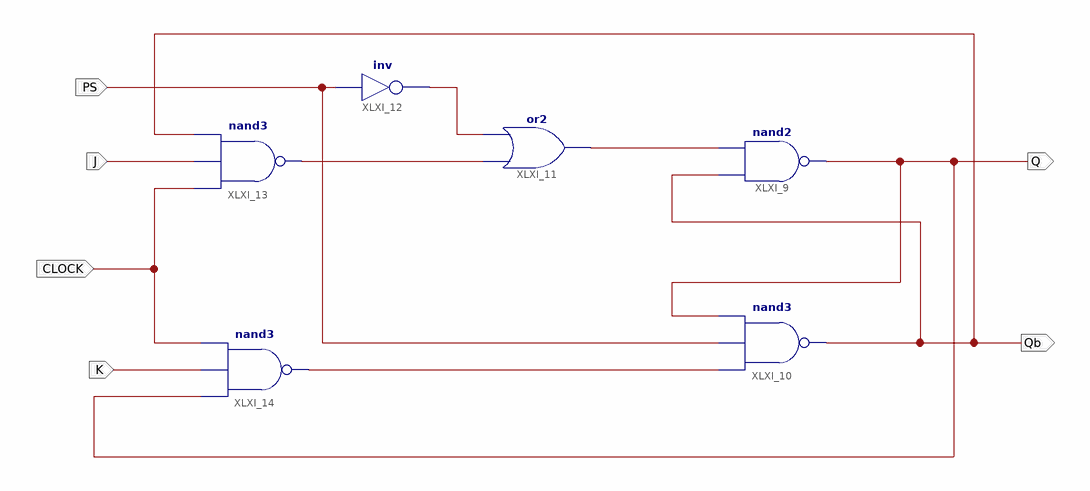
[diagram p0: schematic sheet 1]
// Xilinx ISE schematic JK_Latch.sch (artix7) as structural Verilog: 6 symbols, 6 ports
module JK_Latch (
  input  PS,
  input  CLOCK,
  input  J,
  input  K,
  output Q,
  output Qb
);

  wire XLXN_14, XLXN_16, XLXN_18, XLXN_19;

  nand XLXI_9 (Q, Qb, XLXN_19);
  nand XLXI_10 (Qb, XLXN_16, PS, Q);
  or XLXI_11 (XLXN_19, XLXN_18, XLXN_14);
  not XLXI_12 (XLXN_14, PS);
  nand XLXI_13 (XLXN_18, CLOCK, J, Qb);
  nand XLXI_14 (XLXN_16, Q, K, CLOCK);
endmodule
